# Altium schematic sheet connectivity.SchDoc
size A4
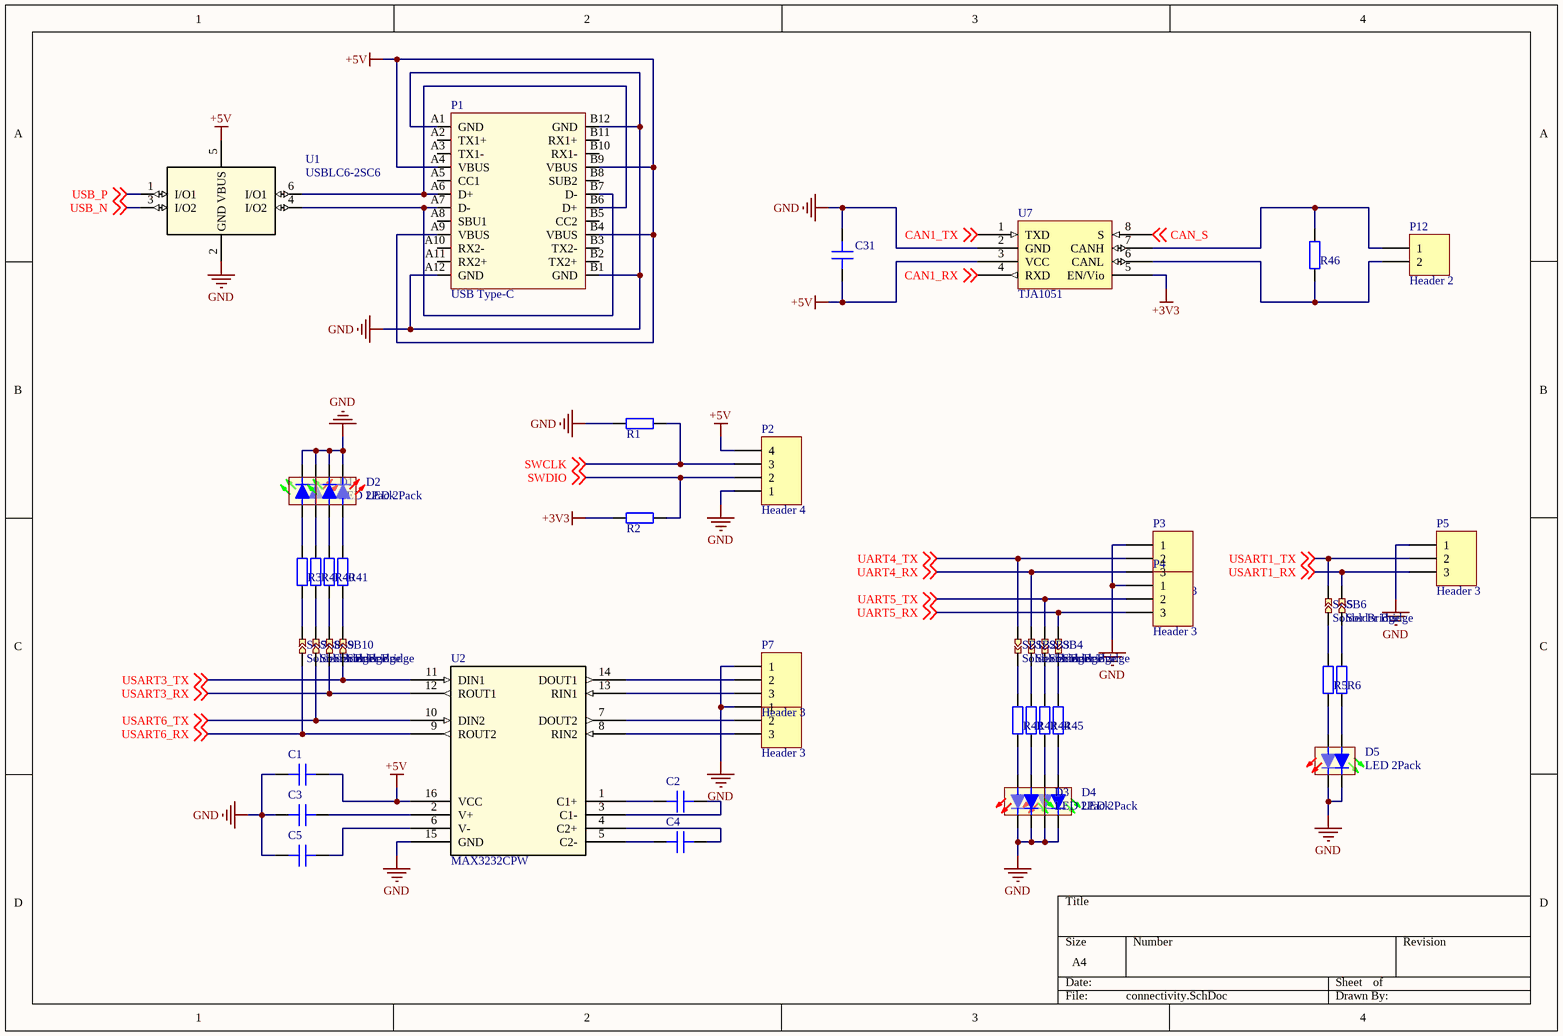
[diagram p0: connectivity.SchDoc]

## Parts
C1  100nF  [CAP 0805]  (value not drawn)
C2  100nF  [CAP 0805]  (value not drawn)
C3  100nF  [CAP 0805]  (value not drawn)
C4  100nF  [CAP 0805]  (value not drawn)
C5  100nF  [CAP 0805]  (value not drawn)
C31  100nF  [CAP 0805]  (value not drawn)
D1  LED 2Pack  [LED-1615]
D2  LED 2Pack  [LED-1615]
D3  LED 2Pack  [LED-1615]
D4  LED 2Pack  [LED-1615]
D5  LED 2Pack  [LED-1615]
P1  USB Type-C  [USB Type-C 24P]
P2  Header 4  [HDR1X4]
P3  Header 3  [MOLEX 53426-0310]
P4  Header 3  [MOLEX 53426-0310]
P5  Header 3  [MOLEX 53426-0310]
P6  Header 3  [MOLEX 53426-0310]
P7  Header 3  [MOLEX 53426-0310]
P12  Header 2  [MOLEX 53426-0210]
R1  10kOhm  [RES 0805]  (value not drawn)
R2  10kOhm  [RES 0805]  (value not drawn)
R3  10kOhm  [RES 0805]  (value not drawn)
R4  10kOhm  [RES 0805]  (value not drawn)
R5  10kOhm  [RES 0805]  (value not drawn)
R6  10kOhm  [RES 0805]  (value not drawn)
R40  10kOhm  [RES 0805]  (value not drawn)
R41  10kOhm  [RES 0805]  (value not drawn)
R42  10kOhm  [RES 0805]  (value not drawn)
R43  10kOhm  [RES 0805]  (value not drawn)
R44  10kOhm  [RES 0805]  (value not drawn)
R45  10kOhm  [RES 0805]  (value not drawn)
R46  10kOhm  [RES 0805]  (value not drawn)
SB1  Solder Bridge  [Solder Bridge]
SB2  Solder Bridge  [Solder Bridge]
SB3  Solder Bridge  [Solder Bridge]
SB4  Solder Bridge  [Solder Bridge]
SB5  Solder Bridge  [Solder Bridge]
SB6  Solder Bridge  [Solder Bridge]
SB7  Solder Bridge  [Solder Bridge]
SB8  Solder Bridge  [Solder Bridge]
SB9  Solder Bridge  [Solder Bridge]
SB10  Solder Bridge  [Solder Bridge]
U1  USBLC6-2SC6  [SOT23-6L_STM]
U2  MAX3232CPW  [TSSOP-16]
U7  TJA1051  [SO-8]

## Nets
+3V3: R2.2 U7.5(EN/Vio)
+5V: C1.2 C31.1 P1.A4(VBUS) P1.A9(VBUS) P1.B4(VBUS) P1.B9(VBUS) P2.4 U1.5(VBUS) U2.16(VCC) U7.3(VCC)
GND: C1.1 C3.1 C5.1 C31.2 D1.1(RK) D1.2(GK) D2.1(RK) D2.2(GK) D3.1(RK) D3.2(GK) D4.1(RK) D4.2(GK) D5.1(RK) D5.2(GK) P1.A1(GND) P1.A12(GND) P1.B1(GND) P1.B12(GND) P2.1 P3.1 P4.1 P5.1 P6.1 P7.1 R1.2 U1.2(GND) U2.15(GND) U7.2(GND)
CAN1_RX: U7.4(RXD) ; off-sheet CAN1_RX
CAN1_TX: U7.1(TXD) ; off-sheet CAN1_TX
CAN_S: U7.8(S) ; off-sheet CAN_S
SWCLK: P2.3 R1.1 ; off-sheet SWCLK
SWDIO: P2.2 R2.1 ; off-sheet SWDIO
UART4_RX: P3.3 SB2.2 ; off-sheet UART4_RX
UART4_TX: P3.2 SB1.2 ; off-sheet UART4_TX
UART5_RX: P4.3 SB4.2 ; off-sheet UART5_RX
UART5_TX: P4.2 SB3.2 ; off-sheet UART5_TX
USART1_RX: P5.3 SB6.1 ; off-sheet USART1_RX
USART1_TX: P5.2 SB5.1 ; off-sheet USART1_TX
USART3_RX: SB9.2 U2.12(ROUT1) ; off-sheet USART3_RX
USART3_TX: SB10.2 U2.11(DIN1) ; off-sheet USART3_TX
USART6_RX: SB7.2 U2.9(ROUT2) ; off-sheet USART6_RX
USART6_TX: SB8.2 U2.10(DIN2) ; off-sheet USART6_TX
USB_N: U1.3(I/O2) ; off-sheet USB_N
USB_P: U1.1(I/O1) ; off-sheet USB_P
NetC2_1: C2.1 U2.1(C1+)
NetC2_2: C2.2 U2.3(C1-)
NetC3_2: C3.2 U2.2(V+)
NetC4_1: C4.1 U2.5(C2-)
NetC4_2: C4.2 U2.4(C2+)
NetC5_2: C5.2 U2.6(V-)
NetD1_3: D1.3(GA) R3.2
NetD1_4: D1.4(RA) R4.2
NetD2_3: D2.3(GA) R40.2
NetD2_4: D2.4(RA) R41.2
NetD3_3: D3.3(GA) R43.1
NetD3_4: D3.4(RA) R42.1
NetD4_3: D4.3(GA) R45.1
NetD4_4: D4.4(RA) R44.1
NetD5_3: D5.3(GA) R6.1
NetD5_4: D5.4(RA) R5.1
NetP1_A6: P1.A6(D+) P1.B6(D+) U1.6(I/O1)
NetP1_A7: P1.A7(D-) P1.B7(D-) U1.4(I/O2)
NetP6_2: P6.2 U2.7(DOUT2)
NetP6_3: P6.3 U2.8(RIN2)
NetP7_2: P7.2 U2.14(DOUT1)
NetP7_3: P7.3 U2.13(RIN1)
NetP12_1: P12.1 R46.1 U7.7(CANH)
NetP12_2: P12.2 R46.2 U7.6(CANL)
NetR3_1: R3.1 SB7.1
NetR4_1: R4.1 SB8.1
NetR5_2: R5.2 SB5.2
NetR6_2: R6.2 SB6.2
NetR40_1: R40.1 SB9.1
NetR41_1: R41.1 SB10.1
NetR42_2: R42.2 SB1.1
NetR43_2: R43.2 SB2.1
NetR44_2: R44.2 SB3.1
NetR45_2: R45.2 SB4.1

Not connected (* = marked no-connect by the designer): P1 A2(TX1+) A3(TX1-) A5(CC1) A8(SBU1) A10(RX2-) A11(RX2+) B2(TX2+) B3(TX2-) B5(CC2) B8(SUB2) B10(RX1-) B11(RX1+)

## Library data of the parts
C1-C5 C31 = Cap: Non-polar capacitor; Published: 8-Jun-2000; LatestRevisionDate: 17-Jul-2002; LatestRevisionNote: Re-released for DXP Platform.; PackageReference: RAD-0.3; Publisher: Altium Limited; PackageDescription: Radial Cap, Thru-Hole; 2 Leads; 0.3 in Pin Spacing
D1-D5 = LED 2Pack: Two seperate LEDs packed together.
P2 = Header 4: Header, 4-Pin; LatestRevisionDate: 17-Jul-2002; LatestRevisionNote: Re-released for DXP Platform.; Publisher: Altium Limited
P3-P7 = Header 3: Header, 3-Pin; LatestRevisionDate: 17-Jul-2002; LatestRevisionNote: Re-released for DXP Platform.; Publisher: Altium Limited
P12 = Header 2: Header, 2-Pin; LatestRevisionDate: 17-Jul-2002; LatestRevisionNote: Re-released for DXP Platform.; Publisher: Altium Limited
R1-R6 R40-R46 = Res: Resistor; Published: 8-Jun-2000; LatestRevisionDate: 17-Jul-2002; LatestRevisionNote: Re-released for DXP Platform.; PackageReference: AXIAL-0.4; Publisher: Altium Limited; PackageDescription: Axial Device, Thru-Hole; 2 Leads; 0.4 in Pin Spacing
U2 = MAX3232CPW: 3-V to 5.5-V Multichannel RS-232 Line Driver/Receiver; Manufacturer: Texas Instruments; INDUSTRY_STD_PKG_TYPE: TSSOP; PIN_COUNT: 16; PACKAGE_DESIGNATOR: PW; Datasheet_URL: http://www.ti.com/lit/gpn/MAX3232; FAMILY_NAME: RS-232; GENERIC_PART_NUMBER: MAX3232; Vendor: Texas Instruments; Manufacturer_Part_Number: MAX3232CPW; Copyright: Copyright (C) 2021 Accelerated Designs. All rights reserved; RefDes: RefDes; Type: DEV
U7 = TJA1051: High-speed CAN transceiver